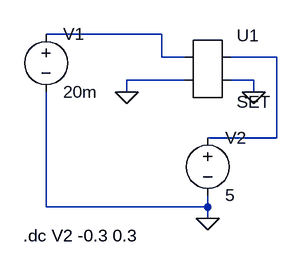
[diagram p0: schematic Draft5.asc]
Draft5.asc, the LTspice schematic file:
Version 4
SHEET 1 880 680
WIRE 176 96 16 96
WIRE 176 128 176 96
WIRE 208 128 176 128
WIRE 336 128 272 128
WIRE 208 160 128 160
WIRE 304 160 272 160
WIRE 128 176 128 160
WIRE 304 176 304 160
WIRE 336 240 336 128
WIRE 336 240 240 240
WIRE 16 336 16 176
WIRE 240 336 240 320
WIRE 240 336 16 336
WIRE 240 352 240 336
FLAG 240 352 0
FLAG 128 176 0
FLAG 304 176 0
SYMBOL voltage 16 80 R0
WINDOW 123 0 0 Left 0
WINDOW 39 0 0 Left 0
SYMATTR InstName V1
SYMATTR Value 20m
SYMBOL voltage 240 224 R0
WINDOW 123 0 0 Left 0
WINDOW 39 0 0 Left 0
SYMATTR InstName V2
SYMATTR Value 5
SYMBOL AutoGenerated\\SET 240 144 R0
SYMATTR InstName U1
SYMATTR SpiceLine C1=1E-20
TEXT -16 376 Left 2 !.dc V2 -0.3 0.3

The netlist it stands for:
* Draft5.asc
V1 N001 0 20m
V2 N002 0 5
* U1: SET C1=1E-20 (symbol AutoGenerated\SET not available, pins judged from their places): pin1=N001 pin2=0 pin3=N002 pin4=0
.dc V2 -0.3 0.3
.backanno
.end